# Altium schematic sheet OLED.SchDoc
size A4; Address1: L3, 12a Rodborough Rd; Address2: Frenchs Forest; Address3: NSW; Address4: Australia 2086; SheetNumber: 7; SheetTotal: 7
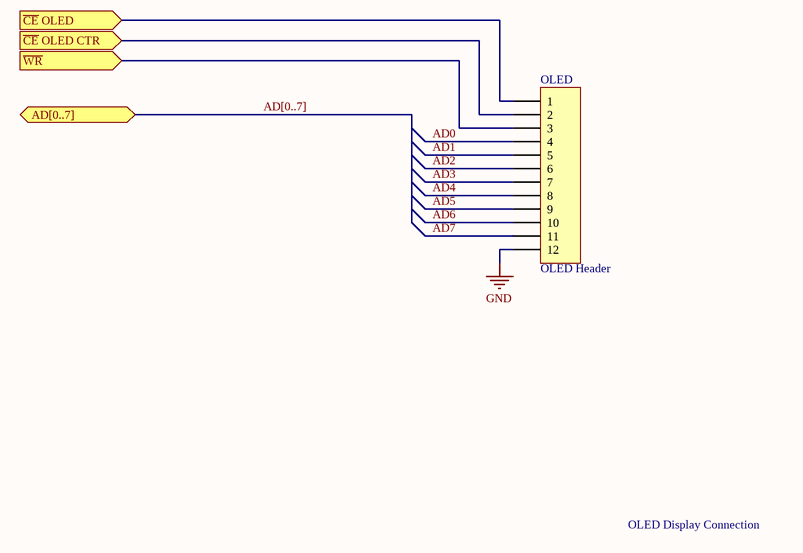
[diagram p0: OLED.SchDoc]

## Parts
OLED  OLED Header  [HDR1X12]

## Ports
AD[0..7] (bidir), ~{CE} OLED (in), ~{CE} OLED CTR (in), ~{WR} (in)

## Nets
GND: OLED.12
AD0: OLED.4
AD1: OLED.5
AD2: OLED.6
AD3: OLED.7
AD4: OLED.8
AD5: OLED.9
AD6: OLED.10
AD7: OLED.11
~{CE} OLED: OLED.1 ; port ~{CE} OLED
~{CE} OLED CTR: OLED.2 ; port ~{CE} OLED CTR
~{WR}: OLED.3 ; port ~{WR}

## Buses and harness runs
bus AD[0..7] = port AD[0..7]

## Notes on the sheet
- OLED Display Connection
- Title:
- Course:
- TTK4155 Industrielle og innbygde datasystemers kontruksjon
- Size:
- Date:
- Author:
- A4
- Moltumyr, Andreas Hanssen
- Number:
- Time:
- Revision:
- Sheet
- of
- File:

## Library data of the parts
OLED = Header 12: Header, 12-Pin; LatestRevisionDate: 17-Jul-2002; LatestRevisionNote: Re-released for DXP Platform.; Publisher: Altium Limited